# Altium schematic sheet jrhahn_pico_pi_scale_cloudless__schematics__Sheet_1_2024-02-07.schdoc
size 185 x 185 mm
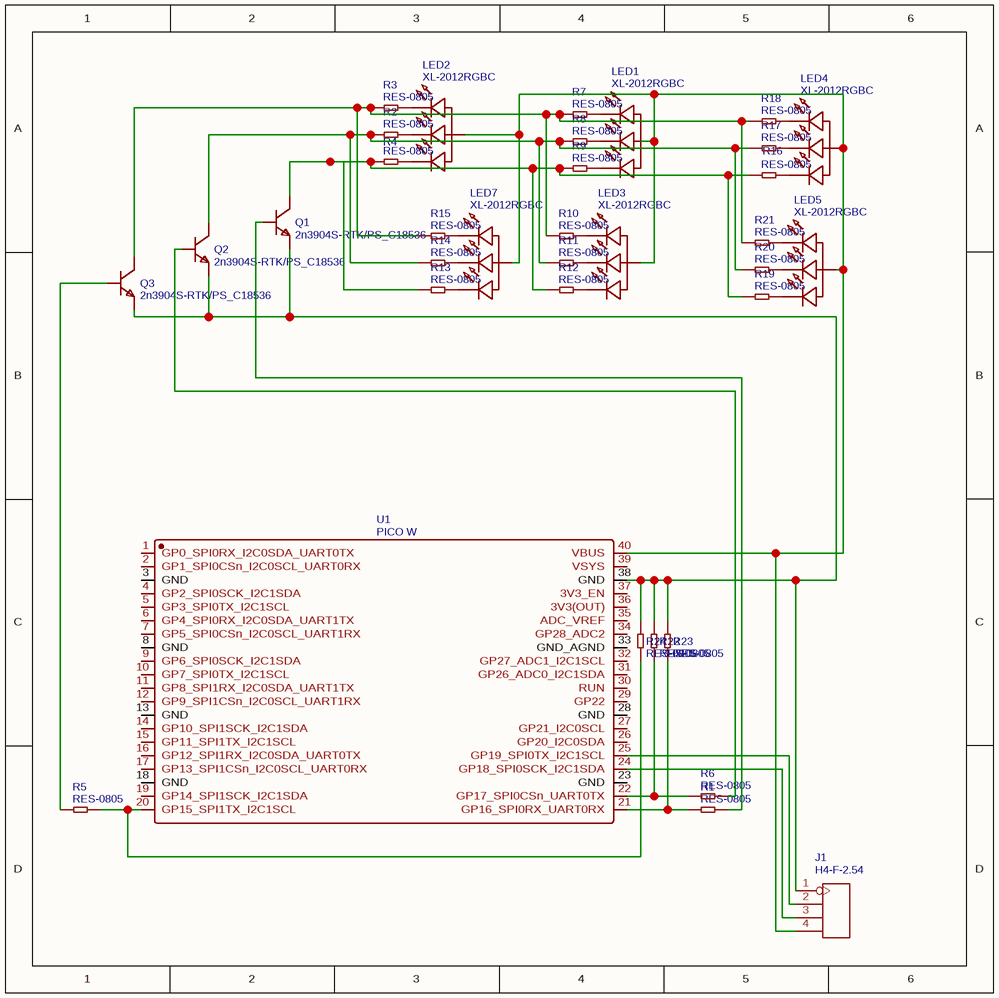
[diagram p0: jrhahn_pico_pi_scale_cloudless__schematics__Sheet_1_2024-02-07.schdoc]

## Parts
J1  H4-F-2.54  [H4-2.54]
LED1  XL-2012RGBC  [LED-SMD_4P-L2.0-W1.3-BR]
LED2  XL-2012RGBC  [LED-SMD_4P-L2.0-W1.3-BR]
LED3  XL-2012RGBC  [LED-SMD_4P-L2.0-W1.3-BR]
LED4  XL-2012RGBC  [LED-SMD_4P-L2.0-W1.3-BR]
LED5  XL-2012RGBC  [LED-SMD_4P-L2.0-W1.3-BR]
LED7  XL-2012RGBC  [LED-SMD_4P-L2.0-W1.3-BR]
Q1  2n3904S-RTK/PS_C18536  [SOT-23-3_L2.9-W1.3-P1.90-LS2.4-TR]
Q2  2n3904S-RTK/PS_C18536  [SOT-23-3_L2.9-W1.3-P1.90-LS2.4-TR]
Q3  2n3904S-RTK/PS_C18536  [SOT-23-3_L2.9-W1.3-P1.90-LS2.4-TR]
R1  RES-0805  [R0805]
R2  RES-0805  [R0805]
R3  RES-0805  [R0805]
R4  RES-0805  [R0805]
R5  RES-0805  [R0805]
R6  RES-0805  [R0805]
R7  RES-0805  [R0805]
R8  RES-0805  [R0805]
R9  RES-0805  [R0805]
R10  RES-0805  [R0805]
R11  RES-0805  [R0805]
R12  RES-0805  [R0805]
R13  RES-0805  [R0805]
R14  RES-0805  [R0805]
R15  RES-0805  [R0805]
R16  RES-0805  [R0805]
R17  RES-0805  [R0805]
R18  RES-0805  [R0805]
R19  RES-0805  [R0805]
R20  RES-0805  [R0805]
R21  RES-0805  [R0805]
R22  RES-0805  [R0805]
R23  RES-0805  [R0805]
R24  RES-0805  [R0805]
U1  PICO W  [LCC-40_L51.0-W21.0-P2.54-BL_RP2040-BASED]

## Nets
NetJ1_1: J1.1(P$1) Q1.1(E) Q2.1(E) Q3.1(E) R22.2 R23.2 R24.2 U1.38(GND)
NetJ1_2: J1.2(P$2) U1.25(GP19_SPI0TX_I2C1SCL)
NetJ1_3: J1.3(P$3) U1.24(GP18_SPI0SCK_I2C1SDA)
NetJ1_4: J1.4(P$4) LED1.3 LED2.3 LED3.3 LED4.3 LED5.3 LED7.3 U1.40(VBUS)
NetLED1_1: LED1.1 R7.2
NetLED1_2: LED1.2 R8.2
NetLED1_4: LED1.4 R9.2
NetLED2_1: LED2.1 R3.2
NetLED2_2: LED2.2 R2.2
NetLED2_4: LED2.4 R4.2
NetLED3_1: LED3.1 R10.2
NetLED3_2: LED3.2 R11.2
NetLED3_4: LED3.4 R12.2
NetLED4_1: LED4.1 R18.2
NetLED4_2: LED4.2 R17.2
NetLED4_4: LED4.4 R16.2
NetLED5_1: LED5.1 R21.2
NetLED5_2: LED5.2 R20.2
NetLED5_4: LED5.4 R19.2
NetLED7_1: LED7.1 R15.2
NetLED7_2: LED7.2 R14.2
NetLED7_4: LED7.4 R13.2
NetQ1_2: Q1.2(B) R1.2
NetQ1_3: Q1.3(C) R4.1 R9.1 R12.1 R13.1 R16.1 R19.1
NetQ2_2: Q2.2(B) R6.2
NetQ2_3: Q2.3(C) R2.1 R8.1 R11.1 R14.1 R17.1 R20.1
NetQ3_2: Q3.2(B) R5.1
NetQ3_3: Q3.3(C) R3.1 R7.1 R10.1 R15.1 R18.1 R21.1
NetR1_1: R1.1 R23.1 U1.21(GP16_SPI0RX_UART0RX)
NetR5_2: R5.2 R24.1 U1.20(GP15_SPI1TX_I2C1SCL)
NetR6_1: R6.1 R22.1 U1.22(GP17_SPI0CSn_UART0TX)

Not connected (* = marked no-connect by the designer): U1 1(GP0_SPI0RX_I2C0SDA_UART0TX) 2(GP1_SPI0CSn_I2C0SCL_UART0RX) 3(GND) 4(GP2_SPI0SCK_I2C1SDA) 5(GP3_SPI0TX_I2C1SCL) 6(GP4_SPI0RX_I2C0SDA_UART1TX) 7(GP5_SPI0CSn_I2C0SCL_UART1RX) 8(GND) 9(GP6_SPI0SCK_I2C1SDA) 10(GP7_SPI0TX_I2C1SCL) 11(GP8_SPI1RX_I2C0SDA_UART1TX) 12(GP9_SPI1CSn_I2C0SCL_UART1RX) 13(GND) 14(GP10_SPI1SCK_I2C1SDA) 15(GP11_SPI1TX_I2C1SCL) 16(GP12_SPI1RX_I2C0SDA_UART0TX) 17(GP13_SPI1CSn_I2C0SCL_UART0RX) 18(GND) 19(GP14_SPI1SCK_I2C1SDA) 23(GND) 26(GP20_I2C0SDA) 27(GP21_I2C0SCL) 28(GND) 29(GP22) 30(RUN) 31(GP26_ADC0_I2C1SDA) 32(GP27_ADC1_I2C1SCL) 33(GND_AGND) 34(GP28_ADC2) 35(ADC_VREF) 36(3V3(OUT)) 37(3V3_EN) 39(VSYS)

## Library data of the parts
LED1-LED5 LED7 = XL-2012RGBC: Manufacturer: XINGLIGHT(成兴光); Contributor: LCSC; Supplier: LCSC; Supplier Part: C965848; Manufacturer Part: XL-2012RGBC; JLCPCB Part Class: Extended Part; spicePre: L; spiceSymbolName: XL-2012RGBC
Q1-Q3 = 2n3904S-RTK/PS_C18536: Manufacturer: KEC; Supplier: LCSC; Manufacturer Part: 2N3904S-RTK/PS; Supplier Part: C18536; JLCPCB Part Class: Extended Part; spicePre: Q; spiceSymbolName: 2n3904S-RTK/PS_C18536
U1 = PICO W: Manufacturer: Raspberry Pi(树莓派); Contributor: lcsc; Supplier: LCSC; Supplier Part: C7203003; Manufacturer Part: PICO W; JLCPCB Part Class: Extended Part; spicePre: U; spiceSymbolName: PICO W
J1 = H4-F-2.54: spicePre: J; spiceSymbolName: H4-F-2.54
R1-R24 = RES-0805: spicePre: R; spiceSymbolName: RES-0805